# Altium schematic sheet LPCB235 - RM48 - ANALOG.SchDoc
size A3; Address1: Unit 4; DocumentNumber: 25; Revision: 2; SheetNumber: 25; SheetTotal: 37; Lockie__PCB_SUB_ASSEMBLY: Analog; Lockie__PCB_ASSEMBLY: FCU PCB; Lockie__LDL: LPCB235; Lockie__PCB_DESCRIPTION: Flight Control Unit
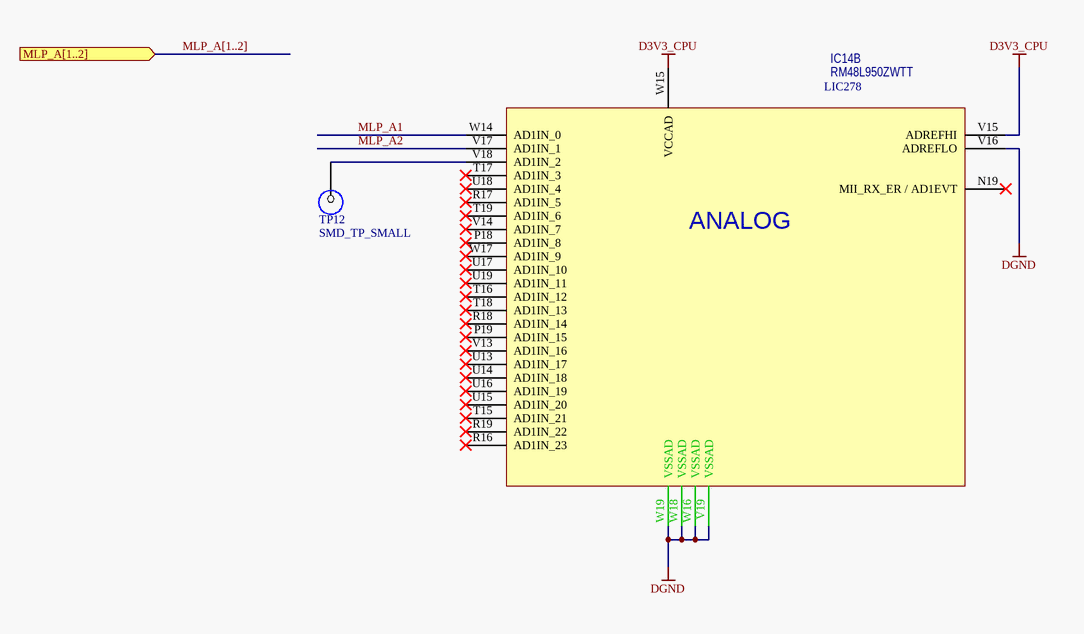
[diagram p0: LPCB235 - RM48 - ANALOG.SchDoc]

## Parts
IC14  RM48L950ZWTT  LDL_NUMBER: LIC278  [LFP054__ZWT (S-PBGA-N337)]  (part B of 10)
TP12  SMD_TP_SMALL  [SMD-TP-SMALL]  (no BOM)

## Ports
MLP_A[1..2] (in)

## Nets
D3V3_CPU: IC14.V15(ADREFHI) IC14.W15(VCCAD)
DGND: IC14.V16(ADREFLO) IC14.V19(VSSAD) IC14.W16(VSSAD) IC14.W18(VSSAD) IC14.W19(VSSAD)
MLP_A1: IC14.W14(AD1IN_0)
MLP_A2: IC14.V17(AD1IN_1)
NetIC14_V18: IC14.V18(AD1IN_2) TP12.1

Not connected (* = marked no-connect by the designer): IC14 N19(MII_RX_ER_/_AD1EVT)* P18(AD1IN_8)* P19(AD1IN_15)* R16(AD1IN_23)* R17(AD1IN_5)* R18(AD1IN_14)* R19(AD1IN_22)* T15(AD1IN_21)* T16(AD1IN_12)* T17(AD1IN_3)* T18(AD1IN_13)* T19(AD1IN_6)* U13(AD1IN_17)* U14(AD1IN_18)* U15(AD1IN_20)* U16(AD1IN_19)* U17(AD1IN_10)* U18(AD1IN_4)* U19(AD1IN_11)* V13(AD1IN_16)* V14(AD1IN_7)* W17(AD1IN_9)*

## Buses and harness runs
bus MLP_A[1..2] = port MLP_A[1..2]

## Notes on the sheet
- PCB COMPONENT DESCRIPTION
- LDL NUMBER
- Assembly Details
- Size
- Drawing File Name
- Revision
- http://rloop.org
- Scale
- A3
- Sheet Details
- N.T.S
- Sheet:
- Of:
- (in symbol RM48L950ZWTT, part B) ANALOG

## Library data of the parts
IC14 = RM48L950ZWTT: IC, CPU, RM48 Safety CPU, SMD NFBGA337 [LIC278]; FMEDA__FUNCTION_IN_SYSTEM: SAFETY CPU 1; FMEDA__OPERATING__TEMP_MIN: -20; FMEDA__OPERATING__TEMP_TYP: 27; FMEDA__OPERATING__TEMP_MAX: 50; FMEDA__CHANNEL: COM
TP12 = SMD_TP_SMALL: SMD Test Point; FMEDA__CHANNEL: COM; FMEDA__OPERATING__CURRENT_MAX: 0; FMEDA__OPERATING__TEMP_MAX: 50; FMEDA__OPERATING__TEMP_MIN: -20; FMEDA__OPERATING__TEMP_TYP: 27; FMEDA__OPERATING__VOLTAGE_MAX: 16; FMEDA__OPERATING__VOLTAGE_TYP: 12; FMEDA__OPERATING__CURRENT_MIN: 0; FMEDA__OPERATING__CURRENT_TYP: 0; FMEDA__OPERATING__VOLTAGE_MIN: 0